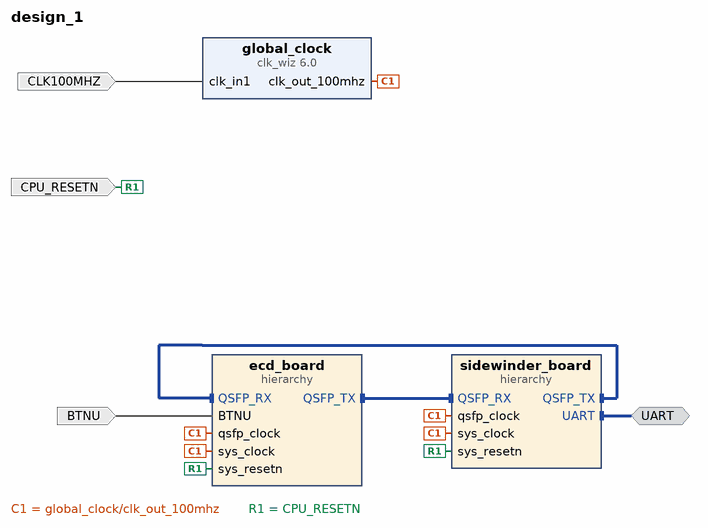
[diagram p0: block diagram of the top level]
# Vivado block design design_1, xc7a100tcsg324-1, Vivado 2021.1
create_bd_design design_1

create_bd_intf_port -mode Master -vlnv xilinx.com:interface:uart_rtl:1.0 UART
create_bd_port -dir I -type rst CPU_RESETN
create_bd_port -dir I -type clk CLK100MHZ
set_property -dict {CONFIG.ASSOCIATED_RESET CPU_RESETN} [get_bd_ports CLK100MHZ]
create_bd_port -dir I BTNU

create_bd_cell -type hier sidewinder_board
create_bd_cell -type ip -vlnv xilinx.com:ip:clk_wiz:6.0 global_clock
set_property -dict [list \
  CONFIG.CLKOUT1_DRIVES BUFGCE \
  CONFIG.CLKOUT1_JITTER 151.636 \
  CONFIG.CLKOUT1_REQUESTED_OUT_FREQ 50.00 \
  CONFIG.CLKOUT2_DRIVES BUFGCE \
  CONFIG.CLKOUT3_DRIVES BUFGCE \
  CONFIG.CLKOUT4_DRIVES BUFGCE \
  CONFIG.CLKOUT5_DRIVES BUFGCE \
  CONFIG.CLKOUT6_DRIVES BUFGCE \
  CONFIG.CLKOUT7_DRIVES BUFGCE \
  CONFIG.CLK_OUT1_PORT clk_out_100mhz \
  CONFIG.FEEDBACK_SOURCE FDBK_AUTO \
  CONFIG.MMCM_CLKOUT0_DIVIDE_F 20.000 \
  CONFIG.USE_LOCKED false \
  CONFIG.USE_RESET false \
  CONFIG.USE_SAFE_CLOCK_STARTUP true \
] [get_bd_cells global_clock]
create_bd_cell -type hier ecd_board

# ---- hierarchy /sidewinder_board ----
current_bd_instance /sidewinder_board
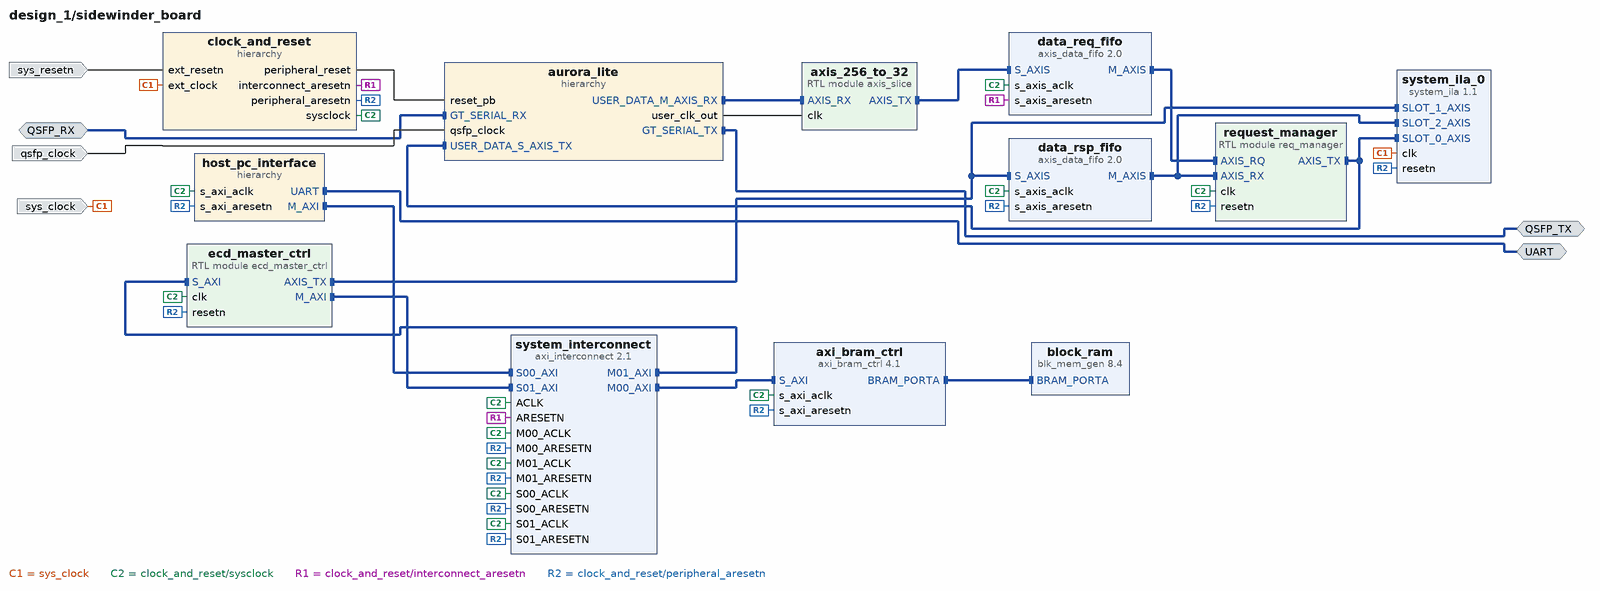
[diagram p1: block diagram inside /sidewinder_board]
create_bd_intf_pin -mode Master -vlnv xilinx.com:interface:uart_rtl:1.0 UART
create_bd_intf_pin -mode Slave -vlnv xilinx.com:interface:axis_rtl:1.0 QSFP_RX
create_bd_intf_pin -mode Master -vlnv xilinx.com:interface:axis_rtl:1.0 QSFP_TX
create_bd_pin -dir I -type rst sys_resetn
create_bd_pin -dir I -type clk sys_clock
create_bd_pin -dir I -type clk qsfp_clock

create_bd_cell -type hier clock_and_reset
create_bd_cell -type hier host_pc_interface
create_bd_cell -type hier aurora_lite
create_bd_cell -type ip -vlnv xilinx.com:ip:axis_data_fifo:2.0 data_req_fifo
set_property -dict {CONFIG.FIFO_DEPTH 64} [get_bd_cells data_req_fifo]
create_bd_cell -type ip -vlnv xilinx.com:ip:blk_mem_gen:8.4 block_ram
create_bd_cell -type ip -vlnv xilinx.com:ip:axi_bram_ctrl:4.1 axi_bram_ctrl
set_property -dict {CONFIG.DATA_WIDTH 512 CONFIG.SINGLE_PORT_BRAM 1} [get_bd_cells axi_bram_ctrl]
create_bd_cell -type ip -vlnv xilinx.com:ip:axis_data_fifo:2.0 data_rsp_fifo
set_property -dict {CONFIG.FIFO_DEPTH 64} [get_bd_cells data_rsp_fifo]
create_bd_cell -type ip -vlnv xilinx.com:ip:axi_interconnect:2.1 system_interconnect
set_property -dict [list \
  CONFIG.ENABLE_ADVANCED_OPTIONS 1 \
  CONFIG.NUM_MI 2 \
  CONFIG.NUM_SI 2 \
  CONFIG.S00_HAS_DATA_FIFO 2 \
  CONFIG.S01_HAS_DATA_FIFO 2 \
  CONFIG.STRATEGY 2 \
  CONFIG.XBAR_DATA_WIDTH 512 \
] [get_bd_cells system_interconnect]
create_bd_cell -type module -reference ecd_master_ctrl ecd_master_ctrl
create_bd_cell -type module -reference axis_slice axis_256_to_32
create_bd_cell -type ip -vlnv xilinx.com:ip:system_ila:1.1 system_ila_0
set_property -dict [list \
  CONFIG.C_MON_TYPE INTERFACE \
  CONFIG.C_NUM_MONITOR_SLOTS 3 \
  CONFIG.C_SLOT_0_APC_EN 0 \
  CONFIG.C_SLOT_0_AXI_DATA_SEL 1 \
  CONFIG.C_SLOT_0_AXI_TRIG_SEL 1 \
  CONFIG.C_SLOT_0_INTF_TYPE xilinx.com:interface:axis_rtl:1.0 \
  CONFIG.C_SLOT_1_APC_EN 0 \
  CONFIG.C_SLOT_1_AXI_DATA_SEL 1 \
  CONFIG.C_SLOT_1_AXI_TRIG_SEL 1 \
  CONFIG.C_SLOT_1_INTF_TYPE xilinx.com:interface:axis_rtl:1.0 \
  CONFIG.C_SLOT_2_APC_EN 0 \
  CONFIG.C_SLOT_2_AXI_DATA_SEL 1 \
  CONFIG.C_SLOT_2_AXI_TRIG_SEL 1 \
  CONFIG.C_SLOT_2_INTF_TYPE xilinx.com:interface:axis_rtl:1.0 \
] [get_bd_cells system_ila_0]
create_bd_cell -type module -reference req_manager request_manager

# ---- hierarchy /sidewinder_board/clock_and_reset ----
current_bd_instance /sidewinder_board/clock_and_reset
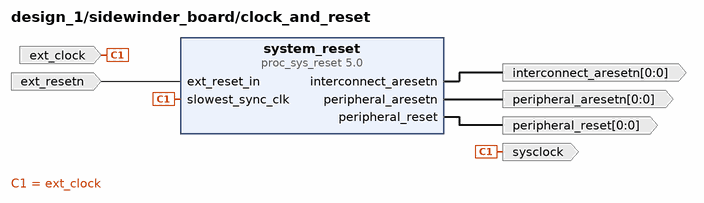
[diagram p2: block diagram inside /sidewinder_board/clock_and_reset]
create_bd_pin -dir I -type clk ext_clock
create_bd_pin -dir O -type clk sysclock
create_bd_pin -dir O -from 0 -to 0 -type rst interconnect_aresetn
create_bd_pin -dir I -type rst ext_resetn
create_bd_pin -dir O -from 0 -to 0 -type rst peripheral_aresetn
create_bd_pin -dir O -from 0 -to 0 -type rst peripheral_reset

create_bd_cell -type ip -vlnv xilinx.com:ip:proc_sys_reset:5.0 system_reset

# ---- hierarchy /sidewinder_board/host_pc_interface ----
current_bd_instance /sidewinder_board/host_pc_interface
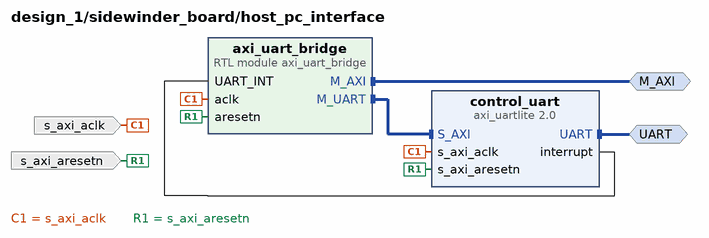
[diagram p3: block diagram inside /sidewinder_board/host_pc_interface]
create_bd_intf_pin -mode Master -vlnv xilinx.com:interface:uart_rtl:1.0 UART
create_bd_intf_pin -mode Master -vlnv xilinx.com:interface:aximm_rtl:1.0 M_AXI
create_bd_pin -dir I -type clk s_axi_aclk
create_bd_pin -dir I -type rst s_axi_aresetn

create_bd_cell -type ip -vlnv xilinx.com:ip:axi_uartlite:2.0 control_uart
set_property -dict {CONFIG.C_BAUDRATE 115200} [get_bd_cells control_uart]
create_bd_cell -type module -reference axi_uart_bridge axi_uart_bridge

# ---- hierarchy /sidewinder_board/aurora_lite ----
current_bd_instance /sidewinder_board/aurora_lite
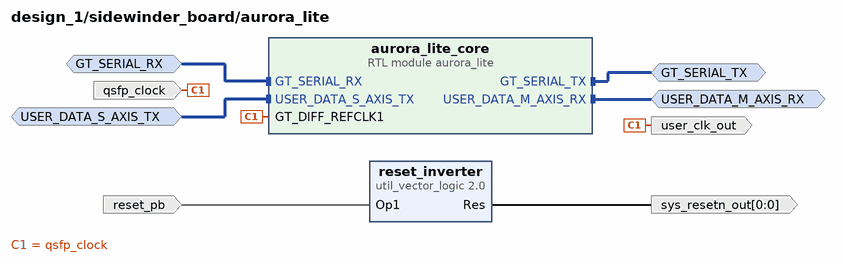
[diagram p4: block diagram inside /sidewinder_board/aurora_lite]
create_bd_intf_pin -mode Slave -vlnv xilinx.com:interface:axis_rtl:1.0 GT_SERIAL_RX
create_bd_intf_pin -mode Master -vlnv xilinx.com:interface:axis_rtl:1.0 GT_SERIAL_TX
create_bd_intf_pin -mode Master -vlnv xilinx.com:interface:axis_rtl:1.0 USER_DATA_M_AXIS_RX
create_bd_intf_pin -mode Slave -vlnv xilinx.com:interface:axis_rtl:1.0 USER_DATA_S_AXIS_TX
create_bd_pin -dir I -type clk qsfp_clock
create_bd_pin -dir I reset_pb
create_bd_pin -dir O user_clk_out
create_bd_pin -dir O -from 0 -to 0 sys_resetn_out

create_bd_cell -type module -reference aurora_lite aurora_lite_core
create_bd_cell -type ip -vlnv xilinx.com:ip:util_vector_logic:2.0 reset_inverter
set_property -dict {CONFIG.C_OPERATION not CONFIG.C_SIZE 1} [get_bd_cells reset_inverter]

# ---- hierarchy /ecd_board ----
current_bd_instance /ecd_board
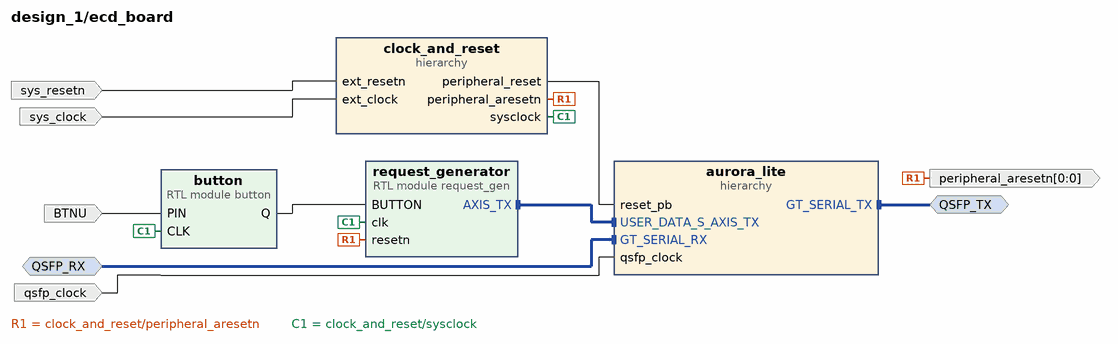
[diagram p5: block diagram inside /ecd_board]
create_bd_intf_pin -mode Master -vlnv xilinx.com:interface:axis_rtl:1.0 QSFP_TX
create_bd_intf_pin -mode Slave -vlnv xilinx.com:interface:axis_rtl:1.0 QSFP_RX
create_bd_pin -dir I -type clk sys_clock
create_bd_pin -dir I -type rst sys_resetn
create_bd_pin -dir I qsfp_clock
create_bd_pin -dir I BTNU
create_bd_pin -dir O -from 0 -to 0 -type rst peripheral_aresetn

create_bd_cell -type hier clock_and_reset
create_bd_cell -type hier aurora_lite
create_bd_cell -type module -reference button button
create_bd_cell -type module -reference request_gen request_generator

# ---- hierarchy /ecd_board/clock_and_reset ----
current_bd_instance /ecd_board/clock_and_reset
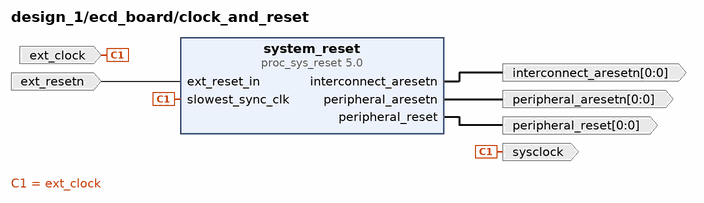
[diagram p6: block diagram inside /ecd_board/clock_and_reset]
create_bd_pin -dir I -type clk ext_clock
create_bd_pin -dir I -type rst ext_resetn
create_bd_pin -dir O -from 0 -to 0 -type rst peripheral_aresetn
create_bd_pin -dir O sysclock
create_bd_pin -dir O -from 0 -to 0 -type rst interconnect_aresetn
create_bd_pin -dir O -from 0 -to 0 -type rst peripheral_reset

create_bd_cell -type ip -vlnv xilinx.com:ip:proc_sys_reset:5.0 system_reset

# ---- hierarchy /ecd_board/aurora_lite ----
current_bd_instance /ecd_board/aurora_lite
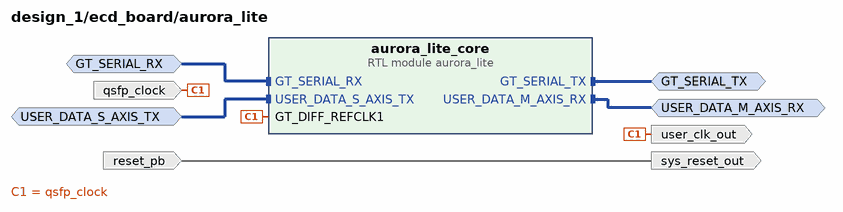
[diagram p7: block diagram inside /ecd_board/aurora_lite]
create_bd_intf_pin -mode Slave -vlnv xilinx.com:interface:axis_rtl:1.0 GT_SERIAL_RX
create_bd_intf_pin -mode Master -vlnv xilinx.com:interface:axis_rtl:1.0 GT_SERIAL_TX
create_bd_intf_pin -mode Master -vlnv xilinx.com:interface:axis_rtl:1.0 USER_DATA_M_AXIS_RX
create_bd_intf_pin -mode Slave -vlnv xilinx.com:interface:axis_rtl:1.0 USER_DATA_S_AXIS_TX
create_bd_pin -dir I qsfp_clock
create_bd_pin -dir O -type clk user_clk_out
create_bd_pin -dir I -type rst reset_pb
create_bd_pin -dir O sys_reset_out

create_bd_cell -type module -reference aurora_lite aurora_lite_core

# ---- connections ----

current_bd_instance /sidewinder_board
connect_bd_intf_net [get_bd_intf_pins QSFP_RX] [get_bd_intf_pins aurora_lite/GT_SERIAL_RX]
connect_bd_intf_net [get_bd_intf_pins QSFP_TX] [get_bd_intf_pins aurora_lite/GT_SERIAL_TX]
connect_bd_intf_net [get_bd_intf_pins aurora_lite/USER_DATA_M_AXIS_RX] [get_bd_intf_pins axis_256_to_32/AXIS_RX]
connect_bd_intf_net [get_bd_intf_pins axi_bram_ctrl/BRAM_PORTA] [get_bd_intf_pins block_ram/BRAM_PORTA]
connect_bd_intf_net [get_bd_intf_pins axi_bram_ctrl/S_AXI] [get_bd_intf_pins system_interconnect/M00_AXI]
connect_bd_intf_net [get_bd_intf_pins ecd_master_ctrl/S_AXI] [get_bd_intf_pins system_interconnect/M01_AXI]
connect_bd_intf_net [get_bd_intf_pins axis_256_to_32/AXIS_TX] [get_bd_intf_pins data_req_fifo/S_AXIS]
connect_bd_intf_net [get_bd_intf_pins request_manager/AXIS_RQ] [get_bd_intf_pins data_req_fifo/M_AXIS]
connect_bd_intf_net [get_bd_intf_pins request_manager/AXIS_RX] [get_bd_intf_pins data_rsp_fifo/M_AXIS]
connect_bd_intf_net [get_bd_intf_pins request_manager/AXIS_RX] [get_bd_intf_pins system_ila_0/SLOT_2_AXIS]
connect_bd_intf_net [get_bd_intf_pins data_rsp_fifo/S_AXIS] [get_bd_intf_pins ecd_master_ctrl/AXIS_TX]
connect_bd_intf_net [get_bd_intf_pins data_rsp_fifo/S_AXIS] [get_bd_intf_pins system_ila_0/SLOT_1_AXIS]
connect_bd_intf_net [get_bd_intf_pins ecd_master_ctrl/M_AXI] [get_bd_intf_pins system_interconnect/S01_AXI]
connect_bd_intf_net [get_bd_intf_pins UART] [get_bd_intf_pins host_pc_interface/UART]
connect_bd_intf_net [get_bd_intf_pins host_pc_interface/M_AXI] [get_bd_intf_pins system_interconnect/S00_AXI]
connect_bd_intf_net [get_bd_intf_pins request_manager/AXIS_TX] [get_bd_intf_pins aurora_lite/USER_DATA_S_AXIS_TX]
connect_bd_intf_net [get_bd_intf_pins request_manager/AXIS_TX] [get_bd_intf_pins system_ila_0/SLOT_0_AXIS]
connect_bd_net -net CLK100MHZ_1 [get_bd_pins sys_clock] [get_bd_pins clock_and_reset/ext_clock] [get_bd_pins system_ila_0/clk]
connect_bd_net -net CPU_RESETN_1 [get_bd_pins sys_resetn] [get_bd_pins clock_and_reset/ext_resetn]
connect_bd_net -net GT_DIFF_REFCLK1_0_1 [get_bd_pins qsfp_clock] [get_bd_pins aurora_lite/qsfp_clock]
connect_bd_net [get_bd_pins aurora_lite/user_clk_out] [get_bd_pins axis_256_to_32/clk]
connect_bd_net -net clock_and_reset_clk_100mhz [get_bd_pins clock_and_reset/sysclock] \
  [get_bd_pins host_pc_interface/s_axi_aclk] [get_bd_pins data_req_fifo/s_axis_aclk] [get_bd_pins axi_bram_ctrl/s_axi_aclk] \
  [get_bd_pins data_rsp_fifo/s_axis_aclk] [get_bd_pins system_interconnect/S01_ACLK] \
  [get_bd_pins system_interconnect/M01_ACLK] [get_bd_pins system_interconnect/ACLK] \
  [get_bd_pins system_interconnect/S00_ACLK] [get_bd_pins system_interconnect/M00_ACLK] [get_bd_pins ecd_master_ctrl/clk] \
  [get_bd_pins request_manager/clk]
connect_bd_net [get_bd_pins clock_and_reset/interconnect_aresetn] [get_bd_pins data_req_fifo/s_axis_aresetn] [get_bd_pins system_interconnect/ARESETN]
connect_bd_net [get_bd_pins clock_and_reset/peripheral_aresetn] \
  [get_bd_pins host_pc_interface/s_axi_aresetn] [get_bd_pins axi_bram_ctrl/s_axi_aresetn] \
  [get_bd_pins data_rsp_fifo/s_axis_aresetn] [get_bd_pins system_interconnect/S01_ARESETN] \
  [get_bd_pins system_interconnect/M00_ARESETN] [get_bd_pins system_interconnect/M01_ARESETN] \
  [get_bd_pins system_interconnect/S00_ARESETN] [get_bd_pins ecd_master_ctrl/resetn] [get_bd_pins system_ila_0/resetn] \
  [get_bd_pins request_manager/resetn]
connect_bd_net [get_bd_pins clock_and_reset/peripheral_reset] [get_bd_pins aurora_lite/reset_pb]

current_bd_instance /sidewinder_board/clock_and_reset
connect_bd_net -net CPU_RESETN_1 [get_bd_pins ext_resetn] [get_bd_pins system_reset/ext_reset_in]
connect_bd_net [get_bd_pins ext_clock] [get_bd_pins sysclock] [get_bd_pins system_reset/slowest_sync_clk]
connect_bd_net [get_bd_pins system_reset/interconnect_aresetn] [get_bd_pins interconnect_aresetn]
connect_bd_net [get_bd_pins system_reset/peripheral_aresetn] [get_bd_pins peripheral_aresetn]
connect_bd_net [get_bd_pins system_reset/peripheral_reset] [get_bd_pins peripheral_reset]

current_bd_instance /sidewinder_board/host_pc_interface
connect_bd_intf_net [get_bd_intf_pins M_AXI] [get_bd_intf_pins axi_uart_bridge/M_AXI]
connect_bd_intf_net [get_bd_intf_pins UART] [get_bd_intf_pins control_uart/UART]
connect_bd_intf_net [get_bd_intf_pins control_uart/S_AXI] [get_bd_intf_pins axi_uart_bridge/M_UART]
connect_bd_net [get_bd_pins control_uart/interrupt] [get_bd_pins axi_uart_bridge/UART_INT]
connect_bd_net [get_bd_pins s_axi_aclk] [get_bd_pins control_uart/s_axi_aclk] [get_bd_pins axi_uart_bridge/aclk]
connect_bd_net [get_bd_pins s_axi_aresetn] [get_bd_pins control_uart/s_axi_aresetn] [get_bd_pins axi_uart_bridge/aresetn]

current_bd_instance /sidewinder_board/aurora_lite
connect_bd_intf_net [get_bd_intf_pins USER_DATA_M_AXIS_RX] [get_bd_intf_pins aurora_lite_core/USER_DATA_M_AXIS_RX]
connect_bd_intf_net [get_bd_intf_pins GT_SERIAL_RX] [get_bd_intf_pins aurora_lite_core/GT_SERIAL_RX]
connect_bd_intf_net [get_bd_intf_pins GT_SERIAL_TX] [get_bd_intf_pins aurora_lite_core/GT_SERIAL_TX]
connect_bd_intf_net [get_bd_intf_pins USER_DATA_S_AXIS_TX] [get_bd_intf_pins aurora_lite_core/USER_DATA_S_AXIS_TX]
connect_bd_net -net GT_DIFF_REFCLK1_0_1 [get_bd_pins qsfp_clock] [get_bd_pins aurora_lite_core/GT_DIFF_REFCLK1] [get_bd_pins user_clk_out]
connect_bd_net [get_bd_pins reset_inverter/Res] [get_bd_pins sys_resetn_out]
connect_bd_net [get_bd_pins reset_pb] [get_bd_pins reset_inverter/Op1]

current_bd_instance /ecd_board
connect_bd_intf_net [get_bd_intf_pins QSFP_RX] [get_bd_intf_pins aurora_lite/GT_SERIAL_RX]
connect_bd_intf_net [get_bd_intf_pins QSFP_TX] [get_bd_intf_pins aurora_lite/GT_SERIAL_TX]
connect_bd_intf_net [get_bd_intf_pins request_generator/AXIS_TX] [get_bd_intf_pins aurora_lite/USER_DATA_S_AXIS_TX]
connect_bd_net -net PIN_0_1 [get_bd_pins BTNU] [get_bd_pins button/PIN]
connect_bd_net -net button_0_Q [get_bd_pins button/Q] [get_bd_pins request_generator/BUTTON]
connect_bd_net [get_bd_pins clock_and_reset/peripheral_aresetn] [get_bd_pins peripheral_aresetn] [get_bd_pins request_generator/resetn]
connect_bd_net [get_bd_pins clock_and_reset/peripheral_reset] [get_bd_pins aurora_lite/reset_pb]
connect_bd_net [get_bd_pins clock_and_reset/sysclock] [get_bd_pins button/CLK] [get_bd_pins request_generator/clk]
connect_bd_net -net ext_reset_in_0_1 [get_bd_pins sys_resetn] [get_bd_pins clock_and_reset/ext_resetn]
connect_bd_net [get_bd_pins qsfp_clock] [get_bd_pins aurora_lite/qsfp_clock]
connect_bd_net -net slowest_sync_clk_0_1 [get_bd_pins sys_clock] [get_bd_pins clock_and_reset/ext_clock]

current_bd_instance /ecd_board/clock_and_reset
connect_bd_net -net ext_reset_in_0_1 [get_bd_pins ext_resetn] [get_bd_pins system_reset/ext_reset_in]
connect_bd_net -net slowest_sync_clk_0_1 [get_bd_pins ext_clock] [get_bd_pins system_reset/slowest_sync_clk] [get_bd_pins sysclock]
connect_bd_net [get_bd_pins system_reset/interconnect_aresetn] [get_bd_pins interconnect_aresetn]
connect_bd_net [get_bd_pins system_reset/peripheral_aresetn] [get_bd_pins peripheral_aresetn]
connect_bd_net [get_bd_pins system_reset/peripheral_reset] [get_bd_pins peripheral_reset]

current_bd_instance /ecd_board/aurora_lite
connect_bd_intf_net [get_bd_intf_pins USER_DATA_M_AXIS_RX] [get_bd_intf_pins aurora_lite_core/USER_DATA_M_AXIS_RX]
connect_bd_intf_net [get_bd_intf_pins GT_SERIAL_RX] [get_bd_intf_pins aurora_lite_core/GT_SERIAL_RX]
connect_bd_intf_net [get_bd_intf_pins GT_SERIAL_TX] [get_bd_intf_pins aurora_lite_core/GT_SERIAL_TX]
connect_bd_intf_net [get_bd_intf_pins USER_DATA_S_AXIS_TX] [get_bd_intf_pins aurora_lite_core/USER_DATA_S_AXIS_TX]
connect_bd_net -net clock_and_reset_peripheral_reset [get_bd_pins reset_pb] [get_bd_pins sys_reset_out]
connect_bd_net [get_bd_pins qsfp_clock] [get_bd_pins aurora_lite_core/GT_DIFF_REFCLK1] [get_bd_pins user_clk_out]

current_bd_instance /
connect_bd_intf_net [get_bd_intf_pins sidewinder_board/QSFP_RX] [get_bd_intf_pins ecd_board/QSFP_TX]
connect_bd_intf_net [get_bd_intf_pins sidewinder_board/QSFP_TX] [get_bd_intf_pins ecd_board/QSFP_RX]
connect_bd_intf_net [get_bd_intf_ports UART] [get_bd_intf_pins sidewinder_board/UART]
connect_bd_net -net CLK100MHZ_1 [get_bd_pins global_clock/clk_out_100mhz] \
  [get_bd_pins sidewinder_board/sys_clock] [get_bd_pins ecd_board/sys_clock] [get_bd_pins sidewinder_board/qsfp_clock] \
  [get_bd_pins ecd_board/qsfp_clock]
connect_bd_net [get_bd_ports CLK100MHZ] [get_bd_pins global_clock/clk_in1]
connect_bd_net [get_bd_ports CPU_RESETN] [get_bd_pins sidewinder_board/sys_resetn] [get_bd_pins ecd_board/sys_resetn]
connect_bd_net -net PIN_0_1 [get_bd_ports BTNU] [get_bd_pins ecd_board/BTNU]

# ---- address map ----
assign_bd_address -offset 0x00000000C0000000 -range 128K -target_address_space [get_bd_addr_spaces sidewinder_board/ecd_master_ctrl/M_AXI] [get_bd_addr_segs sidewinder_board/axi_bram_ctrl/S_AXI/Mem0]
exclude_bd_addr_seg -offset 0x0000000000000100 -range 256 -target_address_space [get_bd_addr_spaces sidewinder_board/ecd_master_ctrl/M_AXI] [get_bd_addr_segs sidewinder_board/ecd_master_ctrl/S_AXI/reg0]
assign_bd_address -offset 0x0000000000001000 -range 4K -target_address_space [get_bd_addr_spaces sidewinder_board/host_pc_interface/axi_uart_bridge/M_AXI] [get_bd_addr_segs sidewinder_board/ecd_master_ctrl/S_AXI/reg0]
assign_bd_address -offset 0x00000000C0000000 -range 128K -target_address_space [get_bd_addr_spaces sidewinder_board/host_pc_interface/axi_uart_bridge/M_AXI] [get_bd_addr_segs sidewinder_board/axi_bram_ctrl/S_AXI/Mem0]
assign_bd_address -offset 0x00000000 -range 4K -target_address_space [get_bd_addr_spaces sidewinder_board/host_pc_interface/axi_uart_bridge/M_UART] [get_bd_addr_segs sidewinder_board/host_pc_interface/control_uart/S_AXI/Reg]

set_property USER_COMMENTS.comment_13 {This 'aurora_lite' simulates a XIlinx Aurora IP
core.   It contains the same basic signals that
an Aurora does, and with the same names.

In a real Aurora, the GT_SERIAL_<RX|TX> lines
are multi-gigabit tranceivers.   Here, they are
AXI streams. } [get_bd_cells /ecd_board/aurora_lite]
set_property USER_COMMENTS.comment_0 {This 'aurora_lite' simulates a XIlinx Aurora IP
core.   It contains the same basic signals that
an Aurora does, and with the same names.

In a real Aurora, the GT_SERIAL_<RX|TX> lines
are multi-gigabit tranceivers.   Here, they are
AXI streams. } [get_bd_cells /ecd_board/aurora_lite]
set_property USER_COMMENTS.comment_15 {This 'aurora_lite' simulates a XIlinx Aurora IP
core.   It contains the same basic signals that
an Aurora does, and with the same names.

In a real Aurora, the GT_SERIAL_<RX|TX> lines
are multi-gigabit tranceivers.   Here, they are
AXI streams. } [get_bd_cells /ecd_board/aurora_lite]
set_property USER_COMMENTS.comment_17 {This 'aurora_lite' simulates a XIlinx Aurora IP
core.   It contains the same basic signals that
an Aurora does, and with the same names.

In a real Aurora, the GT_SERIAL_<RX|TX> lines
are multi-gigabit tranceivers.   Here, they are
AXI streams. } [get_bd_cells /ecd_board/aurora_lite]
set_property USER_COMMENTS.comment_20 {This 'aurora_lite' simulates a XIlinx Aurora IP
core.   It contains the same basic signals that
an Aurora does, and with the same names.

In a real Aurora, the GT_SERIAL_<RX|TX> lines
are multi-gigabit tranceivers.   Here, they are
AXI streams. } [get_bd_cells /ecd_board/aurora_lite]
set_property USER_COMMENTS.comment_22 {This 'aurora_lite' simulates a XIlinx Aurora IP
core.   It contains the same basic signals that
an Aurora does, and with the same names.

In a real Aurora, the GT_SERIAL_<RX|TX> lines
are multi-gigabit tranceivers.   Here, they are
AXI streams. } [get_bd_cells /ecd_board/aurora_lite]
set_property USER_COMMENTS.comment_26 {This 'aurora_lite' simulates a XIlinx Aurora IP
core.   It contains the same basic signals that
an Aurora does, and with the same names.

In a real Aurora, the GT_SERIAL_<RX|TX> lines
are multi-gigabit tranceivers.   Here, they are
AXI streams. } [get_bd_cells /ecd_board/aurora_lite]
set_property USER_COMMENTS.comment_27 {This 'aurora_lite' simulates a XIlinx Aurora IP
core.   It contains the same basic signals that
an Aurora does, and with the same names.

In a real Aurora, the GT_SERIAL_<RX|TX> lines
are multi-gigabit tranceivers.   Here, they are
AXI streams. } [get_bd_cells /ecd_board/aurora_lite]
set_property USER_COMMENTS.comment_29 {This 'aurora_lite' simulates a XIlinx Aurora IP
core.   It contains the same basic signals that
an Aurora does, and with the same names.

In a real Aurora, the GT_SERIAL_<RX|TX> lines
are multi-gigabit tranceivers.   Here, they are
AXI streams. } [get_bd_cells /ecd_board/aurora_lite]
set_property USER_COMMENTS.comment_31 {This 'aurora_lite' simulates a XIlinx Aurora IP
core.   It contains the same basic signals that
an Aurora does, and with the same names.

In a real Aurora, the GT_SERIAL_<RX|TX> lines
are multi-gigabit tranceivers.   Here, they are
AXI streams. } [get_bd_cells /ecd_board/aurora_lite]
set_property USER_COMMENTS.comment_34 {This 'aurora_lite' simulates a XIlinx Aurora IP
core.   It contains the same basic signals that
an Aurora does, and with the same names.

In a real Aurora, the GT_SERIAL_<RX|TX> lines
are multi-gigabit tranceivers.   Here, they are
AXI streams. } [get_bd_cells /ecd_board/aurora_lite]
set_property USER_COMMENTS.comment_38 {This 'aurora_lite' simulates a XIlinx Aurora IP
core.   It contains the same basic signals that
an Aurora does, and with the same names.

In a real Aurora, the GT_SERIAL_<RX|TX> lines
are multi-gigabit tranceivers.   Here, they are
AXI streams. } [get_bd_cells /ecd_board/aurora_lite]
set_property USER_COMMENTS.comment_41 {This 'aurora_lite' simulates a XIlinx Aurora IP
core.   It contains the same basic signals that
an Aurora does, and with the same names.

In a real Aurora, the GT_SERIAL_<RX|TX> lines
are multi-gigabit tranceivers.   Here, they are
AXI streams. } [get_bd_cells /ecd_board/aurora_lite]
set_property USER_COMMENTS.comment_44 {This 'aurora_lite' simulates a XIlinx Aurora IP
core.   It contains the same basic signals that
an Aurora does, and with the same names.

In a real Aurora, the GT_SERIAL_<RX|TX> lines
are multi-gigabit tranceivers.   Here, they are
AXI streams. } [get_bd_cells /ecd_board/aurora_lite]
set_property USER_COMMENTS.comment_48 {This 'aurora_lite' simulates a XIlinx Aurora IP
core.   It contains the same basic signals that
an Aurora does, and with the same names.

In a real Aurora, the GT_SERIAL_<RX|TX> lines
are multi-gigabit tranceivers.   Here, they are
AXI streams. } [get_bd_cells /ecd_board/aurora_lite]
set_property USER_COMMENTS.comment_54 {This 'aurora_lite' simulates a XIlinx Aurora IP
core.   It contains the same basic signals that
an Aurora does, and with the same names.

In a real Aurora, the GT_SERIAL_<RX|TX> lines
are multi-gigabit tranceivers.   Here, they are
AXI streams. } [get_bd_cells /ecd_board/aurora_lite]
set_property USER_COMMENTS.comment_24 {The 'aximm_stream_client' is an 
AXI4-Lite slave device.  AXI read
and write transactions to its 
registers are seamlessly carried
out on the remote system} [get_bd_cells /sidewinder_board]
set_property USER_COMMENTS.comment_0 {This 'aurora_lite' simulates a XIlinx Aurora IP
core.   It contains the same basic signals that
an Aurora does, and with the same names.

In a real Aurora, the GT_SERIAL_<RX|TX> lines
are multi-gigabit tranceivers.   Here, they are
AXI streams. } [get_bd_cells /sidewinder_board/aurora_lite]
set_property USER_COMMENTS.comment_12 {Enter Comments here} [get_bd_cells /sidewinder_board/aurora_lite]
set_property USER_COMMENTS.comment_14 {In this example design, the host
PC interface into our AXI bus is via
a UART.   In a more complex design
the host PC would interface to our
AXI bus via a PCIe bridge} [get_bd_cells /sidewinder_board/host_pc_interface]
set_property USER_COMMENTS.comment_16 {In this example design, the host PC
interfaces to our AXI bus is via UART.

In a more complex design, the host
PC interface might be via a PCIe
bridge} [get_bd_cells /sidewinder_board/host_pc_interface]
set_property USER_COMMENTS.comment_4 {iface comment} [get_bd_cells /sidewinder_board/host_pc_interface]
set_property USER_COMMENTS.comment_7 {iface comment} [get_bd_cells /sidewinder_board/host_pc_interface]
set_property USER_COMMENTS.comment_26 {In this example design, the host
PC interface into our AXI bus is via
a UART.   In a more complex design
the host PC would interface to our
AXI bus via a PCIe bridge} [get_bd_cells /sidewinder_board/host_pc_interface]

validate_bd_design
save_bd_design
